# Altium project PS3604LP.PrjPcb
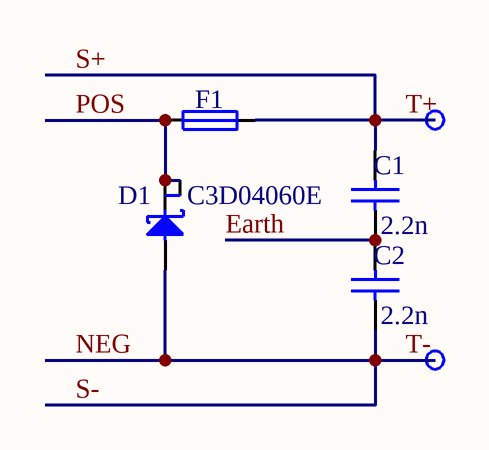
[diagram p0: PS3604LP.SchDoc]
1 sheet, 6 parts. Net scope: global (net labels, ports and power ports of the same name join across sheets).
Board file: PS3604LP.PcbDoc

## Sheet PS3604LP.SchDoc: PS3604LP
size A3; Author: Storozhenko Roman; CompanyName: D_EL; DrawnBy: Storozhenko Roman; Address1: Ukraine; Address2: Kharkiv; Revision: 0.1; SheetNumber: 1; SheetTotal: 1

### Parts
B1  Plated Hole  [MTG420_550]  (value not drawn)
B2  Plated Hole  [MTG420_550]  (value not drawn)
C1  2.2n  [CAPC4532X250N]
C2  2.2n  [CAPC4532X250N]
D1  C3D04060E  [TO228P972X240-3N-R540X510]
F1  0.5A-125V  [FUSE_LITTELFUSE_0154]  (value not drawn)

### Nets
Earth: C1.1 C2.2
NEG: B2.1 C2.1 D1.2(A)  [also labelled S-, T-]
POS: D1.1(C) D1.3(A) F1.1
S+: B1.1 C1.2 F1.2  [also labelled T+]

### Notes on the sheet
- Title
- Size:
- Date:
- A3
- Time:
- Revision:
- Sheet
- of
- File:

### Library data of the parts
B1 B2 = PLATED_HOLE4.2_PAD5.5: Single Terminal Socket; Part Description: Plated Through Hole: Hole Dia.=4.2mm Pad Dia.=5.5mm; Mounted: No; Part Number: PLATED_HOLE4.2_PAD5.5; Component Kind: Standard (No BOM); Component Type: Standard (No BOM); Pin Count: 1; Family: Plated Hole; Socket: No; SMD: No; Status: None; ComponentHeight: 0mm; Author: CERN DEM JMW; CreateDate: 9/27/2011; LatestRevisionDate: 9/27/2011; PackageDescription: Plated Through Hole: Hole Dia.=4.2mm Pad Dia.=5.5mm
C1 C2 = CC1812_2.2NF_1000V_10%_X7R: Non-polarised capacitor; Part Description: SMD Multilayer Chip Ceramic Capacitor; Manufacturer: GENERIC; Manufacturer1 Part Number: 1812Y5000104KXB; Voltage: 1000V; TC: X7R; Tolerance: ±10%; Part Number: CC1812_2.2NF_1000V_10%_X7R; Component Kind: Standard; Component Type: Standard; Pin Count: 2; Value: 2.2n; Status: None; Manufacturer Part Number: CC1812_2.2NF_1000V_10%_X7R; Case: 1812; Mounted: Yes; Socket: No; SMD: Yes; Manufacturer1 Example: SYFER; Manufacturer1 ComponentHeight: 2.5mm; Author: DEL; CreateDate: 10/9/2017; LatestRevisionDate: 10/9/2017
D1 = C3D04060E: Diode  Schottky Anode pin 1 and 2 cathode pin 3; Part Description: Silicon Carbide Schottky Diode; Manufacturer: CREE; Voltage: 600V; Power: 7.5A; Part Number: C3D04060E; Component Kind: Standard; Component Type: Standard; Device: C3D04060E; PackageDescription: DPAK TO-252, 2.28mm pitch; 2 pin, 9.725mm L X 6.10mm W X 2.40mm H body, IPC Medium Density; Manufacturer Part Number: C3D04060E; Pin Count: 3; Case: D-PACK; Mounted: Yes; Socket: No; SMD: Yes; ComponentHeight: 2.39mm; Author: DEL; CreateDate: 9/13/2025; LatestRevisionDate: 9/13/2025
F1 = FUSE_LITTELFUSE_0154.500DR: Fuse; Part Description: SMF OMNI-BLOK® Very Fast-Acting Fuse and Holder; Part Number: FUSE_LITTELFUSE_0154.500DR; Component Kind: Standard; Component Type: Standard; Pin Count: 2; PackageDescription: SMF Fuse and Holder, 2-Leads, Body 9.73x5.03mm; Family: Fuse & Holder; Mounted: Yes; Socket: No; SMD: Yes; Value: 0.5A-125V; Manufacturer: LITTELFUSE; Manufacturer Part Number: 0154.500DR; ComponentHeight: 3.81mm; HelpURL: \\cern.ch\dfs\Applications\Altium\Datasheets\FUSE_LITTELFUSE_0154.pdf; Author: CERN DEM JMW; CreateDate: 1/8/2009; LatestRevisionDate: 1/8/2009